# Altium schematic sheet FPGA_A_B.SchDoc: FIT_PM12 board
size 420 x 297 mm; CheckedBy: G.Kasprowicz; Author: INR Moscow; CompanyName: WUT ISE; DrawnBy: M.Podgórski; Organization: WUT ISE; Address1: PW ISE; Address2: Nowowiejska 15/19 00-665 Warsaw; Address3: gkasprow@gmail.com; DocumentNumber: 30; Revision: 2; SheetNumber: 29; SheetTotal: 34; ModifiedBy: -; CheckedDate: -; Title2: FPGA A B ADC; DivGrp: WUT ISE; Designer: INR RAS; ModifiedDate: -; ProjectName: Sensor Box
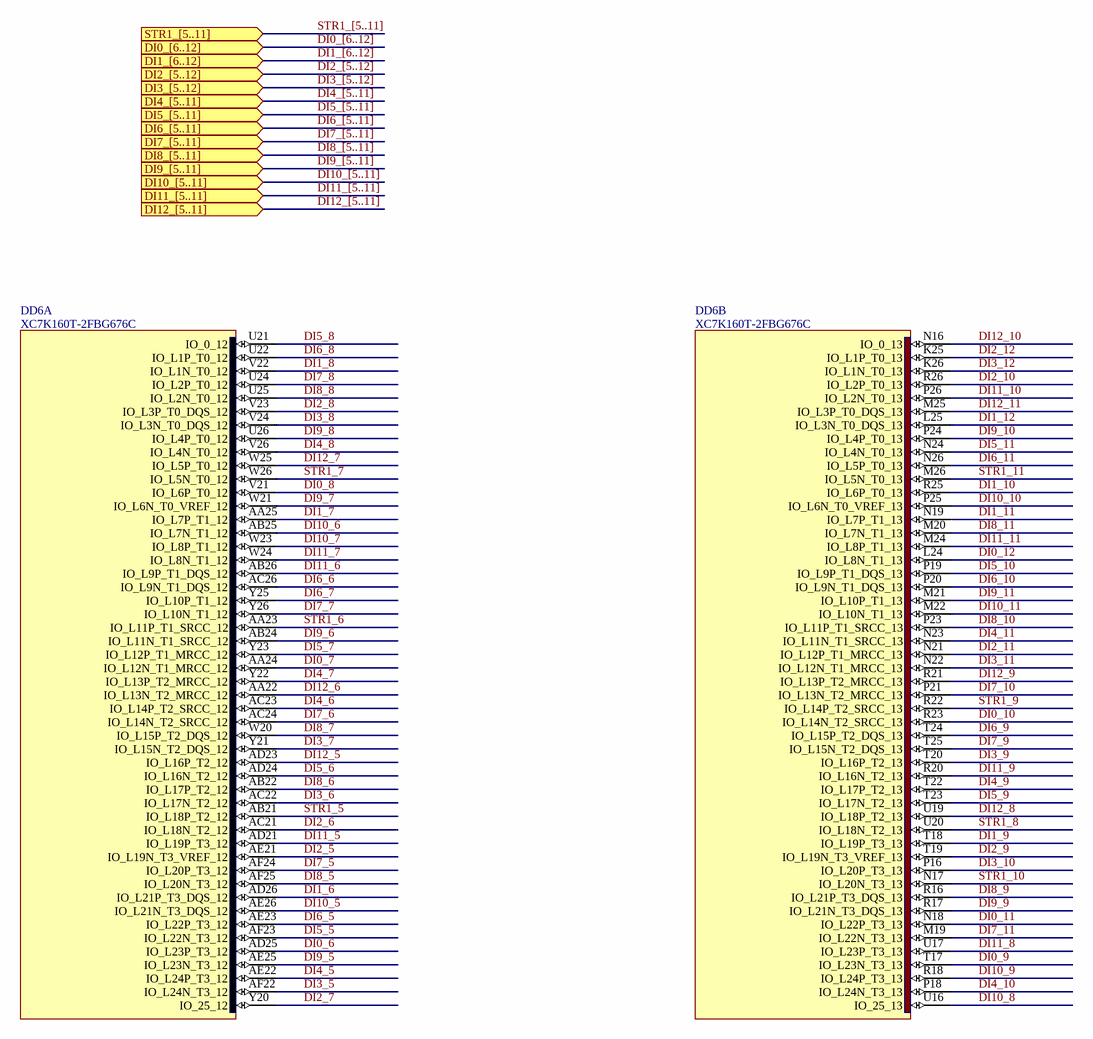
[diagram p0: FPGA_A_B.SchDoc]

## Parts
DD6  XC7K160T-2FBG676C  [BGA676C100P26X26_2700X2700X254]  (parts A,B of 15)

## Ports
DI0_[6..12] (in), DI1_[6..12] (in), DI2_[5..12] (in), DI3_[5..12] (in), DI4_[5..11] (in), DI5_[5..11] (in), DI6_[5..11] (in), DI7_[5..11] (in), DI8_[5..11] (in), DI9_[5..11] (in), DI10_[5..11] (in), DI11_[5..11] (in), DI12_[5..11] (in), STR1_[5..11] (in)

## Nets
DI0_6: DD6.AD25(IO_L23P_T3_12)
DI0_7: DD6.AA24(IO_L12N_T1_MRCC_12)
DI0_8: DD6.V21(IO_L6P_T0_12)
DI0_9: DD6.T17(IO_L23N_T3_13)
DI0_10: DD6.R23(IO_L14N_T2_SRCC_13)
DI0_11: DD6.N18(IO_L22P_T3_13)
DI0_12: DD6.L24(IO_L8N_T1_13)
DI1_6: DD6.AD26(IO_L21P_T3_DQS_12)
DI1_7: DD6.AA25(IO_L7P_T1_12)
DI1_8: DD6.V22(IO_L1N_T0_12)
DI1_9: DD6.T18(IO_L19P_T3_13)
DI1_10: DD6.R25(IO_L6P_T0_13)
DI1_11: DD6.N19(IO_L7P_T1_13)
DI1_12: DD6.L25(IO_L3N_T0_DQS_13)
DI2_5: DD6.AE21(IO_L19N_T3_VREF_12)
DI2_6: DD6.AC21(IO_L18N_T2_12)
DI2_7: DD6.Y20(IO_25_12)
DI2_8: DD6.V23(IO_L3P_T0_DQS_12)
DI2_9: DD6.T19(IO_L19N_T3_VREF_13)
DI2_10: DD6.R26(IO_L2P_T0_13)
DI2_11: DD6.N21(IO_L12P_T1_MRCC_13)
DI2_12: DD6.K25(IO_L1P_T0_13)
DI3_5: DD6.AF22(IO_L24N_T3_12)
DI3_6: DD6.AC22(IO_L17N_T2_12)
DI3_7: DD6.Y21(IO_L15N_T2_DQS_12)
DI3_8: DD6.V24(IO_L3N_T0_DQS_12)
DI3_9: DD6.T20(IO_L16P_T2_13)
DI3_10: DD6.P16(IO_L20P_T3_13)
DI3_11: DD6.N22(IO_L12N_T1_MRCC_13)
DI3_12: DD6.K26(IO_L1N_T0_13)
DI4_5: DD6.AE22(IO_L24P_T3_12)
DI4_6: DD6.AC23(IO_L14P_T2_SRCC_12)
DI4_7: DD6.Y22(IO_L13P_T2_MRCC_12)
DI4_8: DD6.V26(IO_L4N_T0_12)
DI4_9: DD6.T22(IO_L17P_T2_13)
DI4_10: DD6.P18(IO_L24N_T3_13)
DI4_11: DD6.N23(IO_L11N_T1_SRCC_13)
DI5_5: DD6.AF23(IO_L22N_T3_12)
DI5_6: DD6.AD24(IO_L16N_T2_12)
DI5_7: DD6.Y23(IO_L12P_T1_MRCC_12)
DI5_8: DD6.U21(IO_0_12)
DI5_9: DD6.T23(IO_L17N_T2_13)
DI5_10: DD6.P19(IO_L9P_T1_DQS_13)
DI5_11: DD6.N24(IO_L4N_T0_13)
DI6_5: DD6.AE23(IO_L22P_T3_12)
DI6_6: DD6.AC26(IO_L9N_T1_DQS_12)
DI6_7: DD6.Y25(IO_L10P_T1_12)
DI6_8: DD6.U22(IO_L1P_T0_12)
DI6_9: DD6.T24(IO_L15P_T2_DQS_13)
DI6_10: DD6.P20(IO_L9N_T1_DQS_13)
DI6_11: DD6.N26(IO_L5P_T0_13)
DI7_5: DD6.AF24(IO_L20P_T3_12)
DI7_6: DD6.AC24(IO_L14N_T2_SRCC_12)
DI7_7: DD6.Y26(IO_L10N_T1_12)
DI7_8: DD6.U24(IO_L2P_T0_12)
DI7_9: DD6.T25(IO_L15N_T2_DQS_13)
DI7_10: DD6.P21(IO_L13N_T2_MRCC_13)
DI7_11: DD6.M19(IO_L22N_T3_13)
DI8_5: DD6.AF25(IO_L20N_T3_12)
DI8_6: DD6.AB22(IO_L17P_T2_12)
DI8_7: DD6.W20(IO_L15P_T2_DQS_12)
DI8_8: DD6.U25(IO_L2N_T0_12)
DI8_9: DD6.R16(IO_L21P_T3_DQS_13)
DI8_10: DD6.P23(IO_L11P_T1_SRCC_13)
DI8_11: DD6.M20(IO_L7N_T1_13)
DI9_5: DD6.AE25(IO_L23N_T3_12)
DI9_6: DD6.AB24(IO_L11N_T1_SRCC_12)
DI9_7: DD6.W21(IO_L6N_T0_VREF_12)
DI9_8: DD6.U26(IO_L4P_T0_12)
DI9_9: DD6.R17(IO_L21N_T3_DQS_13)
DI9_10: DD6.P24(IO_L4P_T0_13)
DI9_11: DD6.M21(IO_L10P_T1_13)
DI10_5: DD6.AE26(IO_L21N_T3_DQS_12)
DI10_6: DD6.AB25(IO_L7N_T1_12)
DI10_7: DD6.W23(IO_L8P_T1_12)
DI10_8: DD6.U16(IO_25_13)
DI10_9: DD6.R18(IO_L24P_T3_13)
DI10_10: DD6.P25(IO_L6N_T0_VREF_13)
DI10_11: DD6.M22(IO_L10N_T1_13)
DI11_5: DD6.AD21(IO_L19P_T3_12)
DI11_6: DD6.AB26(IO_L9P_T1_DQS_12)
DI11_7: DD6.W24(IO_L8N_T1_12)
DI11_8: DD6.U17(IO_L23P_T3_13)
DI11_9: DD6.R20(IO_L16N_T2_13)
DI11_10: DD6.P26(IO_L2N_T0_13)
DI11_11: DD6.M24(IO_L8P_T1_13)
DI12_5: DD6.AD23(IO_L16P_T2_12)
DI12_6: DD6.AA22(IO_L13N_T2_MRCC_12)
DI12_7: DD6.W25(IO_L5P_T0_12)
DI12_8: DD6.U19(IO_L18P_T2_13)
DI12_9: DD6.R21(IO_L13P_T2_MRCC_13)
DI12_10: DD6.N16(IO_0_13)
DI12_11: DD6.M25(IO_L3P_T0_DQS_13)
STR1_5: DD6.AB21(IO_L18P_T2_12)
STR1_6: DD6.AA23(IO_L11P_T1_SRCC_12)
STR1_7: DD6.W26(IO_L5N_T0_12)
STR1_8: DD6.U20(IO_L18N_T2_13)
STR1_9: DD6.R22(IO_L14P_T2_SRCC_13)
STR1_10: DD6.N17(IO_L20N_T3_13)
STR1_11: DD6.M26(IO_L5N_T0_13)

## Buses and harness runs
bus DI0_[6..12] = port DI0_[6..12]
bus DI1_[6..12] = port DI1_[6..12]
bus DI2_[5..12] = port DI2_[5..12]
bus DI3_[5..12] = port DI3_[5..12]
bus DI4_[5..11] = port DI4_[5..11]
bus DI5_[5..11] = port DI5_[5..11]
bus DI6_[5..11] = port DI6_[5..11]
bus DI7_[5..11] = port DI7_[5..11]
bus DI8_[5..11] = port DI8_[5..11]
bus DI9_[5..11] = port DI9_[5..11]
bus DI10_[5..11] = port DI10_[5..11]
bus DI11_[5..11] = port DI11_[5..11]
bus DI12_[5..11] = port DI12_[5..11]
bus STR1_[5..11] = port STR1_[5..11]

## Notes on the sheet
- Project/Equipment
- Document
- Designer
- Drawn by
- Check.by
- Copyright WUT ISE 2024.
  This documentation describes Open Hardware and is licensed under the CERN OHL v.2. You may redistribute and modify this documentation under the terms of the CERN OHL v.2. (http://ohwr.org/CERNOHL). This documentation is distributed WITHOUT ANY EXPRESS OR IMPLIED WARRANTY, INCLUDING OF MERCHANTABILITY, SATISFACTORY QUALITY AND FITNESS FOR A PARTICULAR PURPOSE. Please see the CERN OHL v.2 for applicable conditions.
- Contact
- File
- Last Mod.
- Print Date
- Sheet
- Size
- A3
- of
- Rev

## Library data of the parts
DD6 = XC7K160T-2FBG676C: KINTEX-7, FPGA, 676-Ball BGA, Pb-Free; Part Description: KINTEX-7 FPGA, 162240 Logic Cells, 400 User I/O, 8 GTXs, 676-Ball BGA, Speed Grade 2, Commercial Grade, Pb-Free; Manufacturer: XILINX; PressFit: No; Bonding: No; Part Number: XC7K160T-2FBG676C; Component Kind: Standard; Component Type: Standard; Device: XC7K160T-2FBG676C; PackageDescription: BGA, 1.00mm Pitch, Square; 676 Pin, 26 Columns X 26 Rows, Body 27.0mm X 27.0mm X 2.54mm H, IPC Medium Density; Manufacturer Part Number: XC7K160T-2FBG676C; Pin Count: 676; Case: BGA676; Mounted: Yes; Socket: No; SMD: Yes; Sense: No; ComponentHeight: 2.54mm; HelpURL: \\cern.ch\dfs\Applications\Altium\Datasheets\XC7K160T-xFBG676C.pdf; ComponentLink1URL: \\cern.ch\dfs\Applications\Altium\Datasheets\XC7K160T-xFBG676C_Package-Pinout.pdf; ComponentLink1Description: Package/Pinout; Author: CERN DEM BC; CreateDate: 06.02.2020; LatestRevisionDate: 06.02.2020